# Altium schematic sheet LAUNCHXL-F28377S_5.SchDoc: LAUNCHXL-F28377S.sch
size 301 x 237 mm; Date: 6/30/2015 1:28:00 PM; DocumentNumber: Document Number:; Revision: REV:; SheetNumber: 6
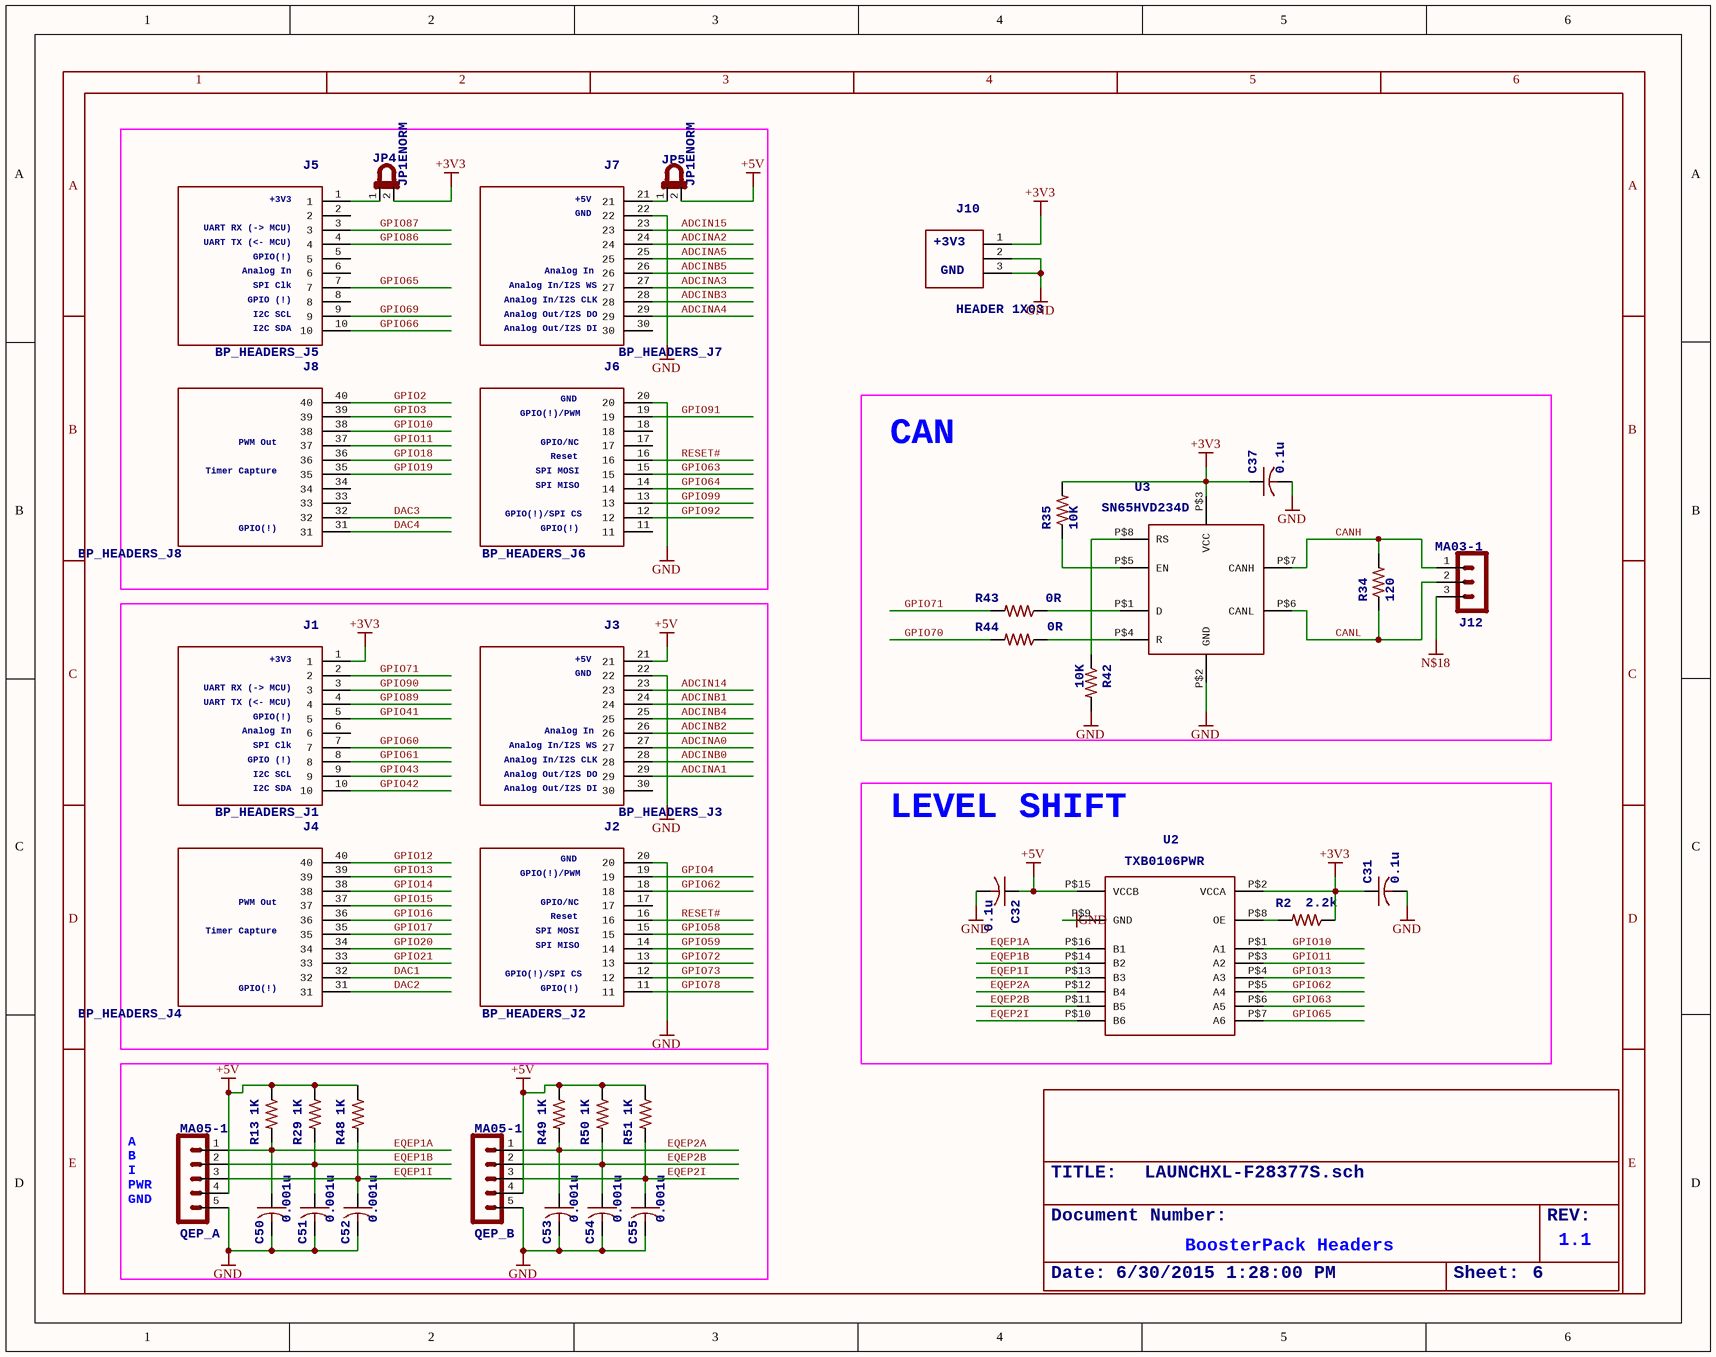
[diagram p0: LAUNCHXL-F28377S_5.SchDoc]

## Parts
C31  0.1u  [C0402]
C32  0.1u  [C0402]
C37  0.1u  [C0402]
C50  0.001u  [C0402]
C51  0.001u  [C0402]
C52  0.001u  [C0402]
C53  0.001u  [C0402]
C54  0.001u  [C0402]
C55  0.001u  [C0402]
J1  BP_HEADERS_J1  [J1]
J2  BP_HEADERS_J2  [J2]
J3  BP_HEADERS_J3  [J3]
J4  BP_HEADERS_J4  [J4]
J5  BP_HEADERS_J5  [J5]
J6  BP_HEADERS_J6  [J6]
J7  BP_HEADERS_J7  [J7]
J8  BP_HEADERS_J8  [J8]
J10  HEADER 1X03  [3PIN_PWR_3V3]
J12  MA03-1  [MA03-1]
JP4  JP1ENORM  [JP1]
JP5  JP1ENORM  [JP1]
QEP_A  MA05-1  [MA05-1]
QEP_B  MA05-1  [MA05-1]
R2  2.2k  [R0402]
R13  1K  [R0402]
R29  1K  [R0402]
R34  120  [R0402]
R35  10K  [R0402]
R42  10K  [R0402]
R43  0R  [R0402]
R44  0R  [R0402]
R48  1K  [R0402]
R49  1K  [R0402]
R50  1K  [R0402]
R51  1K  [R0402]
U2  TXB0106PWR  [TSSOP16-PW]
U3  SN65HVD234D  [SOIC8-PDSO]
U$12  ROY_JUMPER  [ROY_JUMPER]  (value not drawn)
U$13  ROY_JUMPER  [ROY_JUMPER]  (value not drawn)

## Blocks framed on the sheet
CAN: C37 J12 R34 R35 R42-R44 U3
LEVEL SHIFT: C31 C32 R2 U2

## Nets
+3V3: C31.1 C37.1 J1.1 J10.1 JP4.2 R2.1 R35.2 U2.P$2(VCCA) U3.P$3(VCC)
EQEP1A: C32.1 C50.1 C51.1 C52.1 C53.1 C54.1 C55.1 J3.21 JP5.2 QEP_A.1 QEP_A.2 QEP_A.3 QEP_A.4 QEP_B.1 QEP_B.2 QEP_B.3 QEP_B.4 R13.1 R13.2 R29.1 R29.2 R48.1 R48.2 R49.1 R49.2 R50.1 R50.2 R51.1 R51.2 U2.P$10(B6) U2.P$11(B5) U2.P$12(B4) U2.P$13(B3) U2.P$14(B2) U2.P$15(VCCB) U2.P$16(B1)  [also labelled +5V, EQEP1B, EQEP1I, EQEP2A, EQEP2B, EQEP2I]
GND: C31.2 C32.2 C37.2 C50.2 C51.2 C52.2 C53.2 C54.2 C55.2 J2.20 J3.22 J6.20 J7.22 J10.2 J10.3 QEP_A.5 QEP_B.5 R42.2 U2.P$9(GND) U3.P$2(GND)
N$18: J12.3
ADCIN14: J3.23
ADCIN15: J7.23
ADCINA0: J3.27
ADCINA1: J3.29
ADCINA2: J7.24
ADCINA3: J7.27
ADCINA4: J7.29
ADCINA5: J7.25
ADCINB0: J3.28
ADCINB1: J3.24
ADCINB2: J3.26
ADCINB3: J7.28
ADCINB4: J3.25
ADCINB5: J7.26
CANH: J12.1 R34.2 U3.P$7(CANH)
CANL: J12.2 R34.1 U3.P$6(CANL)
DAC1: J4.32
DAC2: J4.31
DAC3: J8.32
DAC4: J8.31
GPIO2: J8.40
GPIO3: J8.39
GPIO4: J2.19
GPIO10: J8.38 U2.P$1(A1)
GPIO11: J8.37 U2.P$3(A2)
GPIO12: J4.40
GPIO13: J4.39 U2.P$4(A3)
GPIO14: J4.38
GPIO15: J4.37
GPIO16: J4.36
GPIO17: J4.35
GPIO18: J8.36
GPIO19: J8.35
GPIO20: J4.34
GPIO21: J4.33
GPIO41: J1.5
GPIO42: J1.10
GPIO43: J1.9
GPIO58: J2.15
GPIO59: J2.14
GPIO60: J1.7
GPIO61: J1.8
GPIO62: J2.18 U2.P$5(A4)
GPIO63: J6.15 U2.P$6(A5)
GPIO64: J6.14
GPIO65: J5.7 U2.P$7(A6)
GPIO66: J5.10
GPIO69: J5.9
GPIO70: R44.2
GPIO71: J1.2 R43.2
GPIO72: J2.13
GPIO73: J2.12
GPIO78: J2.11
GPIO86: J5.4
GPIO87: J5.3
GPIO89: J1.4
GPIO90: J1.3
GPIO91: J6.19
GPIO92: J6.12
GPIO99: J6.13
RESET#: J2.16 J6.16
NetJ5_1: J5.1 JP4.1
NetJ7_21: J7.21 JP5.1
NetR2_2: R2.2 U2.P$8(OE)
NetR35_1: R35.1 U3.P$5(EN)
NetR42_1: R42.1 U3.P$8(RS)
NetR43_1: R43.1 U3.P$1(D)
NetR44_1: R44.1 U3.P$4(R)

Not connected (* = marked no-connect by the designer): J1 6; J2 17; J3 30; J5 2 5 6 8; J6 11 17 18; J7 30; J8 33 34

## Notes on the sheet
- A
- B
- I
- (near QEP_A) GND
- (near QEP_A) PWR
- BoosterPack Headers
- 1.1
- 1
- 2
- 3
- 4
- 5
- 6
- C
- D
- E

## Library data of the parts
C31 C32 C37 C50-C55 = C-USC0402: <B>CAPACITOR</B>, American symbol
J10 = BP_HEADERS_PWR_3V3-TH: CCO: 258-0001299; DESCRIPTION: CONN HEADER .100 SINGL STR 3POS; MAN: SULLINS; VALUE: HEADER 1X03; +3V3: +3V3; GND: GND
J12 = MA03-1: <b>PIN HEADER</b>; OC_FARNELL: unknown; OC_NEWARK: unknown
JP4 JP5 = JP1ENORM: <b>JUMPER</b>
QEP_A QEP_B = MA05-1: <b>PIN HEADER</b>; OC_FARNELL: unknown; OC_NEWARK: unknown
R2 R13 R29 R34 R35 R42-R44 R48-R51 = R-US_R0402: <B>RESISTOR</B>, American symbol
J1 = BP_HEADERS_J1: +3V3: +3V3; Analog In: Analog In; UART RX (-> MCU): UART RX (-> MCU); UART TX (<- MCU): UART TX (<- MCU); GPIO(!): GPIO(!); SPI Clk: SPI Clk; GPIO (!): GPIO (!); I2C SCL: I2C SCL; I2C SDA: I2C SDA
J2 = BP_HEADERS_J2: GND: GND; GPIO(!)/PWM: GPIO(!)/PWM; GPIO(!)/SPI CS: GPIO(!)/SPI CS; GPIO/NC: GPIO/NC; Reset: Reset; SPI MOSI: SPI MOSI; SPI MISO: SPI MISO; GPIO(!): GPIO(!)
J3 = BP_HEADERS_J3: +5V: +5V; GND: GND; Analog In: Analog In; Analog In/I2S WS: Analog In/I2S WS; Analog In/I2S CLK: Analog In/I2S CLK; Analog Out/I2S DO: Analog Out/I2S DO; Analog Out/I2S DI: Analog Out/I2S DI
J4 = BP_HEADERS_J4: PWM Out: PWM Out; Timer Capture: Timer Capture; GPIO(!): GPIO(!)
J5 = BP_HEADERS_J5: +3V3: +3V3; Analog In: Analog In; UART RX (-> MCU): UART RX (-> MCU); UART TX (<- MCU): UART TX (<- MCU); GPIO(!): GPIO(!); SPI Clk: SPI Clk; GPIO (!): GPIO (!); I2C SCL: I2C SCL; I2C SDA: I2C SDA
J6 = BP_HEADERS_J6: GND: GND; GPIO(!)/PWM: GPIO(!)/PWM; GPIO(!)/SPI CS: GPIO(!)/SPI CS; GPIO/NC: GPIO/NC; Reset: Reset; SPI MOSI: SPI MOSI; SPI MISO: SPI MISO; GPIO(!): GPIO(!)
J7 = BP_HEADERS_J7: +5V: +5V; GND: GND; Analog In: Analog In; Analog In/I2S WS: Analog In/I2S WS; Analog In/I2S CLK: Analog In/I2S CLK; Analog Out/I2S DO: Analog Out/I2S DO; Analog Out/I2S DI: Analog Out/I2S DI
J8 = BP_HEADERS_J8: PWM Out: PWM Out; Timer Capture: Timer Capture; GPIO(!): GPIO(!)